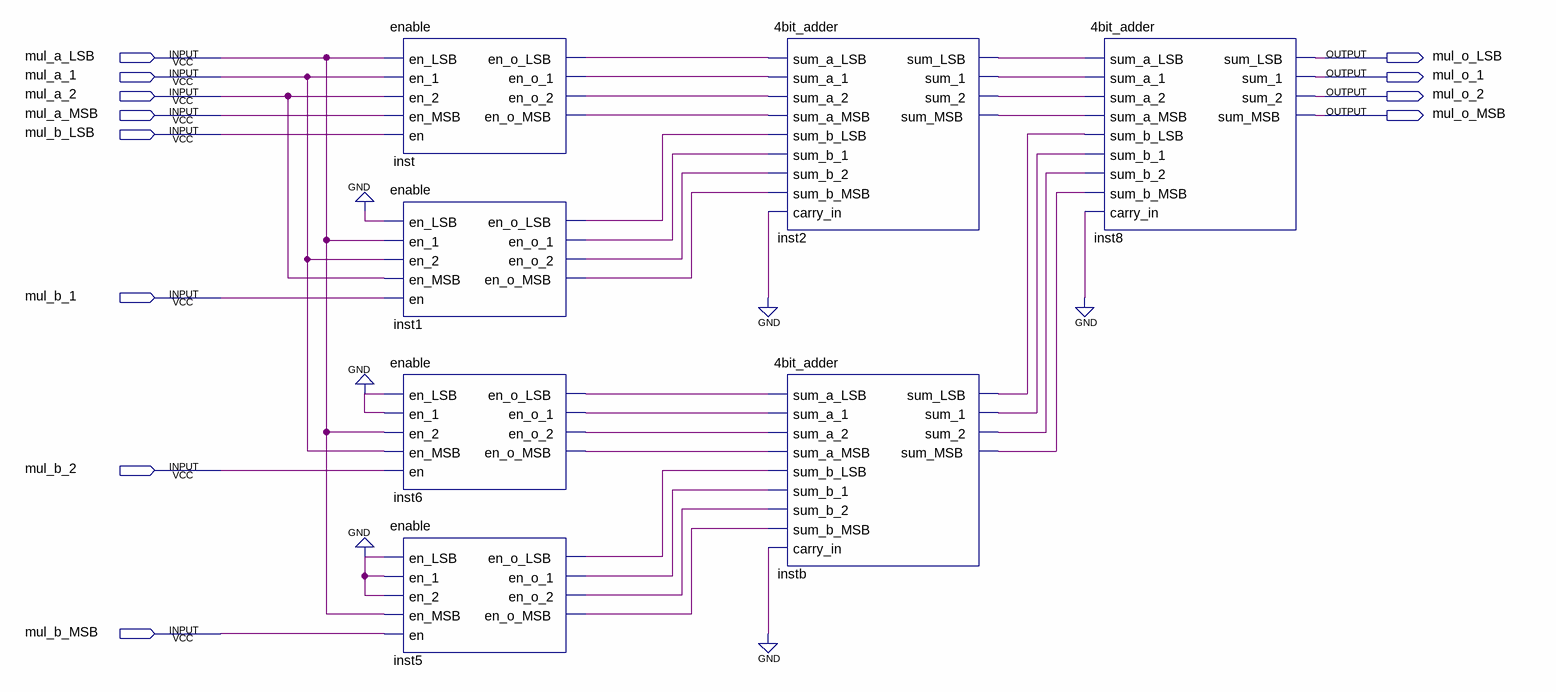
[diagram p0: schematic sheet]
// Quartus schematic 4bit_multiplier.bdf as structural Verilog: 7 symbols, 12 pins
module \4bit_multiplier  (
  input  mul_a_LSB,
  input  mul_a_1,
  input  mul_a_2,
  input  mul_a_MSB,
  input  mul_b_LSB,
  input  mul_b_1,
  input  mul_b_2,
  input  mul_b_MSB,
  output mul_o_LSB,
  output mul_o_1,
  output mul_o_2,
  output mul_o_MSB
);

  wire inst1_en_o_1, inst1_en_o_2, inst1_en_o_lsb, inst1_en_o_msb, inst2_sum_1, inst2_sum_2, inst2_sum_lsb,
       inst2_sum_msb, inst5_en_o_1, inst5_en_o_2, inst5_en_o_lsb, inst5_en_o_msb, inst6_en_o_1, inst6_en_o_2,
       inst6_en_o_lsb, inst6_en_o_msb, inst_en_o_1, inst_en_o_2, inst_en_o_lsb, inst_en_o_msb, instb_sum_1,
       instb_sum_2, instb_sum_lsb, instb_sum_msb;

  enable inst (
    .en_LSB(mul_a_LSB), .en_1(mul_a_1), .en_2(mul_a_2), .en_MSB(mul_a_MSB), .en(mul_b_LSB),
    .en_o_LSB(inst_en_o_lsb), .en_o_1(inst_en_o_1), .en_o_2(inst_en_o_2), .en_o_MSB(inst_en_o_msb));
  enable inst1 (
    .en_LSB(1'b0), .en_1(mul_a_LSB), .en_2(mul_a_1), .en_MSB(mul_a_2), .en(mul_b_1),
    .en_o_LSB(inst1_en_o_lsb), .en_o_1(inst1_en_o_1), .en_o_2(inst1_en_o_2), .en_o_MSB(inst1_en_o_msb));
  enable inst6 (
    .en_LSB(1'b0), .en_1(1'b0), .en_2(mul_a_LSB), .en_MSB(mul_a_1), .en(mul_b_2), .en_o_LSB(inst6_en_o_lsb),
    .en_o_1(inst6_en_o_1), .en_o_2(inst6_en_o_2), .en_o_MSB(inst6_en_o_msb));
  enable inst5 (
    .en_LSB(1'b0), .en_1(1'b0), .en_2(1'b0), .en_MSB(mul_a_LSB), .en(mul_b_MSB), .en_o_LSB(inst5_en_o_lsb),
    .en_o_1(inst5_en_o_1), .en_o_2(inst5_en_o_2), .en_o_MSB(inst5_en_o_msb));
  \4bit_adder  inst2 (
    .sum_a_LSB(inst_en_o_lsb), .sum_a_1(inst_en_o_1), .sum_a_2(inst_en_o_2), .sum_a_MSB(inst_en_o_msb),
    .sum_b_LSB(inst1_en_o_lsb), .sum_b_1(inst1_en_o_1), .sum_b_2(inst1_en_o_2), .sum_b_MSB(inst1_en_o_msb),
    .carry_in(1'b0), .sum_LSB(inst2_sum_lsb), .sum_1(inst2_sum_1), .sum_2(inst2_sum_2),
    .sum_MSB(inst2_sum_msb));
  \4bit_adder  instb (
    .sum_a_LSB(inst6_en_o_lsb), .sum_a_1(inst6_en_o_1), .sum_a_2(inst6_en_o_2), .sum_a_MSB(inst6_en_o_msb),
    .sum_b_LSB(inst5_en_o_lsb), .sum_b_1(inst5_en_o_1), .sum_b_2(inst5_en_o_2), .sum_b_MSB(inst5_en_o_msb),
    .carry_in(1'b0), .sum_LSB(instb_sum_lsb), .sum_1(instb_sum_1), .sum_2(instb_sum_2),
    .sum_MSB(instb_sum_msb));
  \4bit_adder  inst8 (
    .sum_a_LSB(inst2_sum_lsb), .sum_a_1(inst2_sum_1), .sum_a_2(inst2_sum_2), .sum_a_MSB(inst2_sum_msb),
    .sum_b_LSB(instb_sum_lsb), .sum_b_1(instb_sum_1), .sum_b_2(instb_sum_2), .sum_b_MSB(instb_sum_msb),
    .carry_in(1'b0), .sum_LSB(mul_o_LSB), .sum_1(mul_o_1), .sum_2(mul_o_2), .sum_MSB(mul_o_MSB));
endmodule
